# Altium project ESP.PrjPcb
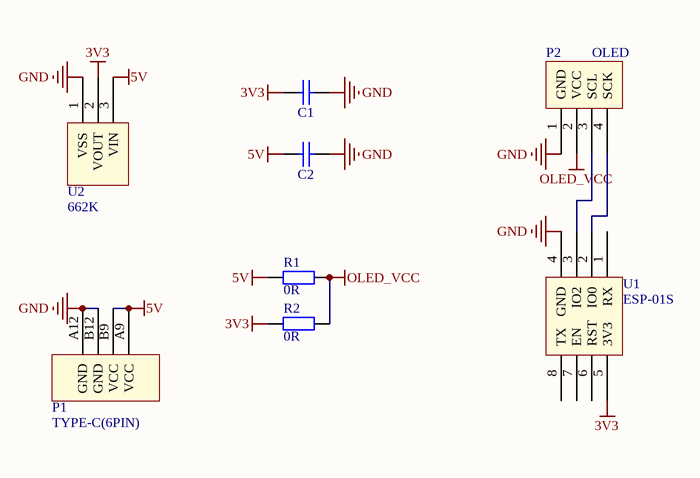
[diagram p0: Sheet1.SchDoc]
1 sheet, 8 parts. Net scope: global (net labels, ports and power ports of the same name join across sheets).
Board file: PCB1.PcbDoc

## Sheet Sheet1.SchDoc
size A4

### Parts
C1  (no value)  [C 0805]
C2  (no value)  [C 0805]
P1  TYPE-C(6PIN)  [USB-C/S_C]
P2  OLED  [P4]
R1  0R  [R 0805]
R2  0R  [R 0805]
U1  ESP-01S  [ESP-01&01S Module]
U2  662K  [SOT23-3N]

### Nets
3V3: C1.1 R2.2 U1.5(3V3) U2.2(VOUT)
5V: C2.1 P1.A9(VCC) P1.B9(VCC) R1.2 U2.3(VIN)
GND: C1.2 C2.2 P1.A12(GND) P1.B12(GND) P2.1(GND) U1.4(GND) U2.1(VSS)
OLED_VCC: P2.2(VCC) R1.1 R2.1
NetP2_3: P2.3(SCL) U1.3(IO2)
NetP2_4: P2.4(SCK) U1.2(IO0)

Not connected (* = marked no-connect by the designer): U1 1(RX) 6(RST) 7(EN) 8(TX)

### Library data of the parts
C1 C2 = Cap1: 无极性电容
R1 R2 = Res: 电阻; value: 10K